# Altium schematic sheet Indicators.SchDoc: Indicators
size A4; DrawnBy: Sem Kirkels; DocumentNumber: 22-23P01S03; Revision: V1; SheetNumber: 3; SheetTotal: 5
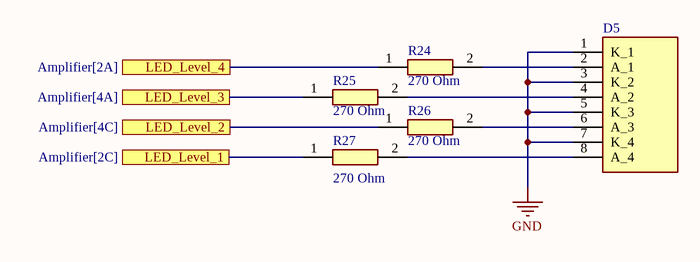
[diagram p0: Indicators.SchDoc]

## Parts
D5  LED Bar  [LED_Bar]  (value not drawn)
R24  270 Ohm  [0805]
R25  270 Ohm  [0805]
R26  270 Ohm  [0805]
R27  270 Ohm  [0805]

## Ports
LED_Level_1 (see Amplifier[2C]), LED_Level_2 (see Amplifier[4C]), LED_Level_3 (see Amplifier[4A]), LED_Level_4 (see Amplifier[2A])

## Nets
GND: D5.1(K_1) D5.3(K_2) D5.5(K_3) D5.7(K_4)
LED_Level_1: R27.1 ; port LED_Level_1
LED_Level_2: R26.1 ; port LED_Level_2
LED_Level_3: R25.1 ; port LED_Level_3
LED_Level_4: R24.1 ; port LED_Level_4
NetD5_2: D5.2(A_1) R24.2
NetD5_4: D5.4(A_2) R25.2
NetD5_6: D5.6(A_3) R26.2
NetD5_8: D5.8(A_4) R27.2

## Library data of the parts
D5 = LED Bar: SSB-LX2550SGW; Manufacturer_Name: Lumex; Datasheet Link: https://www.mouser.fr/datasheet/2/244/SSB-LX2550SGW-1777056.pdf; Height: 7.37mm; Manufacturer_Part_Number: SSB-LX2550SGW; Mouser Part Number: 696-SSB-LX2550SGW; Mouser Price/Stock: https://www.mouser.co.uk/ProductDetail/Lumex/SSB-LX2550SGW?qs=K%252Bxkc0srH7Bp%252B5yK7Wnd0w%3D%3D
R24-R27 = Resistor: Manufacturer_Name: YAGEO; Manufacturer_Part_Number: RP0805BRD071KL; Datasheet Link: https://www.yageo.com/upload/media/product/products/datasheet/rchip/PYu-RP_51_RoHS_L_0.pdf; Height: 0.6mm; Mouser Part Number: 603-RP0805BRD071KL; Mouser Price/Stock: https://www.mouser.co.uk/ProductDetail/YAGEO/RP0805BRD071KL?qs=Y0Uzf4wQF3m8mAbG54g63Q%3D%3D